# Altium schematic sheet SevenSegment.SchDoc
size A4; SheetNumber: 1; SheetTotal: 1
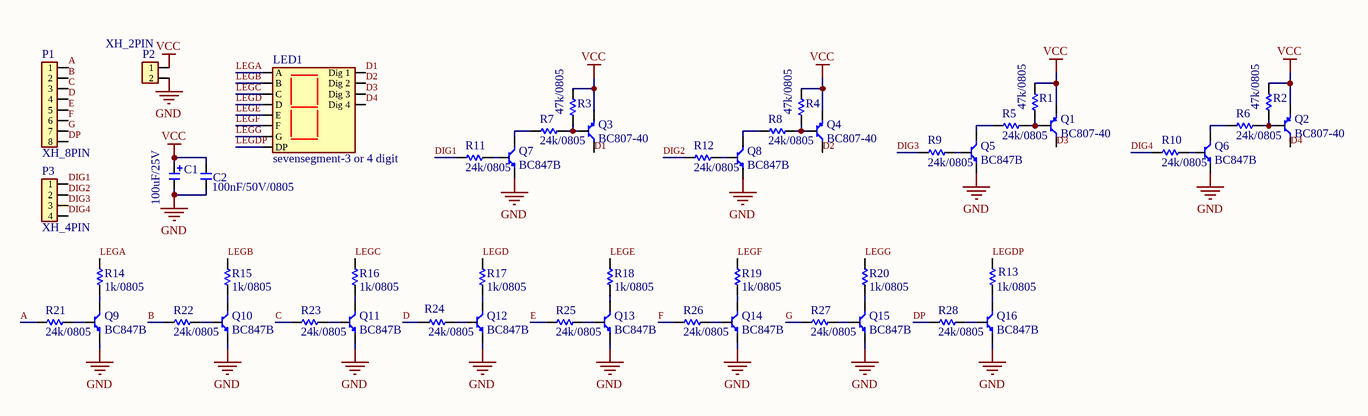
[diagram p0: SevenSegment.SchDoc]

## Parts
C1  100uF/25V  [100uF/25V]
C2  100nF/50V/0805  [Capacitor 0805]
LED1  sevensegment-3 or 4 digit  [5631BS-7SEG]
P1  XH_8PIN  [pin-header 8*1]
P2  XH_2PIN  [pin-header 2*1]
P3  XH_4PIN  [pin-header 4*1]
Q1  BC807-40  [SOT23]
Q2  BC807-40  [SOT23]
Q3  BC807-40  [SOT23]
Q4  BC807-40  [SOT23]
Q5  BC847B  [SOT23]
Q6  BC847B  [SOT23]
Q7  BC847B  [SOT23]
Q8  BC847B  [SOT23]
Q9  BC847B  [SOT23]
Q10  BC847B  [SOT23]
Q11  BC847B  [SOT23]
Q12  BC847B  [SOT23]
Q13  BC847B  [SOT23]
Q14  BC847B  [SOT23]
Q15  BC847B  [SOT23]
Q16  BC847B  [SOT23]
R1  47k/0805  [Resistor 0805]
R2  47k/0805  [Resistor 0805]
R3  47k/0805  [Resistor 0805]
R4  47k/0805  [Resistor 0805]
R5  24k/0805  [Resistor 0805]
R6  24k/0805  [Resistor 0805]
R7  24k/0805  [Resistor 0805]
R8  24k/0805  [Resistor 0805]
R9  24k/0805  [Resistor 0805]
R10  24k/0805  [Resistor 0805]
R11  24k/0805  [Resistor 0805]
R12  24k/0805  [Resistor 0805]
R13  1k/0805  [Resistor 0805]
R14  1k/0805  [Resistor 0805]
R15  1k/0805  [Resistor 0805]
R16  1k/0805  [Resistor 0805]
R17  1k/0805  [Resistor 0805]
R18  1k/0805  [Resistor 0805]
R19  1k/0805  [Resistor 0805]
R20  1k/0805  [Resistor 0805]
R21  24k/0805  [Resistor 0805]
R22  24k/0805  [Resistor 0805]
R23  24k/0805  [Resistor 0805]
R24  24k/0805  [Resistor 0805]
R25  24k/0805  [Resistor 0805]
R26  24k/0805  [Resistor 0805]
R27  24k/0805  [Resistor 0805]
R28  24k/0805  [Resistor 0805]

## Nets
GND: C1.2 C2.1 P2.2 Q5.2(E) Q6.2(E) Q7.2(E) Q8.2(E) Q9.2(E) Q10.2(E) Q11.2(E) Q12.2(E) Q13.2(E) Q14.2(E) Q15.2(E) Q16.2(E)
VCC: C1.1 C2.2 P2.1 Q1.2(E) Q2.2(E) Q3.2(E) Q4.2(E) R1.2 R2.2 R3.2 R4.2
A: P1.1 R21.2
B: P1.2 R22.2
C: P1.3 R23.2
D: P1.4 R24.2
D1: LED1.12(Dig_1) Q3.3(C)
D2: LED1.9(Dig_2) Q4.3(C)
D3: LED1.8(Dig_3) Q1.3(C)
D4: LED1.6(Dig_4) Q2.3(C)
DIG1: P3.1 R11.2
DIG2: P3.2 R12.2
DIG3: P3.3 R9.2
DIG4: P3.4 R10.2
DP: P1.8 R28.2
E: P1.5 R25.2
F: P1.6 R26.2
G: P1.7 R27.2
LEGA: LED1.11(A) R14.1
LEGB: LED1.7(B) R15.1
LEGC: LED1.4(C) R16.1
LEGD: LED1.2(D) R17.1
LEGDP: LED1.3(DP) R13.1
LEGE: LED1.1(E) R18.1
LEGF: LED1.10(F) R19.1
LEGG: LED1.5(G) R20.1
NetQ1_1: Q1.1(B) R1.1 R5.2
NetQ2_1: Q2.1(B) R2.1 R6.2
NetQ3_1: Q3.1(B) R3.1 R7.2
NetQ4_1: Q4.1(B) R4.1 R8.2
NetQ5_1: Q5.1(B) R9.1
NetQ5_3: Q5.3(C) R5.1
NetQ6_1: Q6.1(B) R10.1
NetQ6_3: Q6.3(C) R6.1
NetQ7_1: Q7.1(B) R11.1
NetQ7_3: Q7.3(C) R7.1
NetQ8_1: Q8.1(B) R12.1
NetQ8_3: Q8.3(C) R8.1
NetQ9_1: Q9.1(B) R21.1
NetQ9_3: Q9.3(C) R14.2
NetQ10_1: Q10.1(B) R22.1
NetQ10_3: Q10.3(C) R15.2
NetQ11_1: Q11.1(B) R23.1
NetQ11_3: Q11.3(C) R16.2
NetQ12_1: Q12.1(B) R24.1
NetQ12_3: Q12.3(C) R17.2
NetQ13_1: Q13.1(B) R25.1
NetQ13_3: Q13.3(C) R18.2
NetQ14_1: Q14.1(B) R26.1
NetQ14_3: Q14.3(C) R19.2
NetQ15_1: Q15.1(B) R27.1
NetQ15_3: Q15.3(C) R20.2
NetQ16_1: Q16.1(B) R28.1
NetQ16_3: Q16.3(C) R13.2

## Library data of the parts
C1 = Capacitor-pol
C2 = capacitor
P1 = header 8pin
P2 = header 2pin
P3 = header 4pin
Q1-Q4 = bjt-pnp
Q5-Q16 = bjt-npn
R1-R28 = resistor